# Altium schematic sheet Mainboard_Encoder_Interface.SchDoc
size 381 x 254 mm
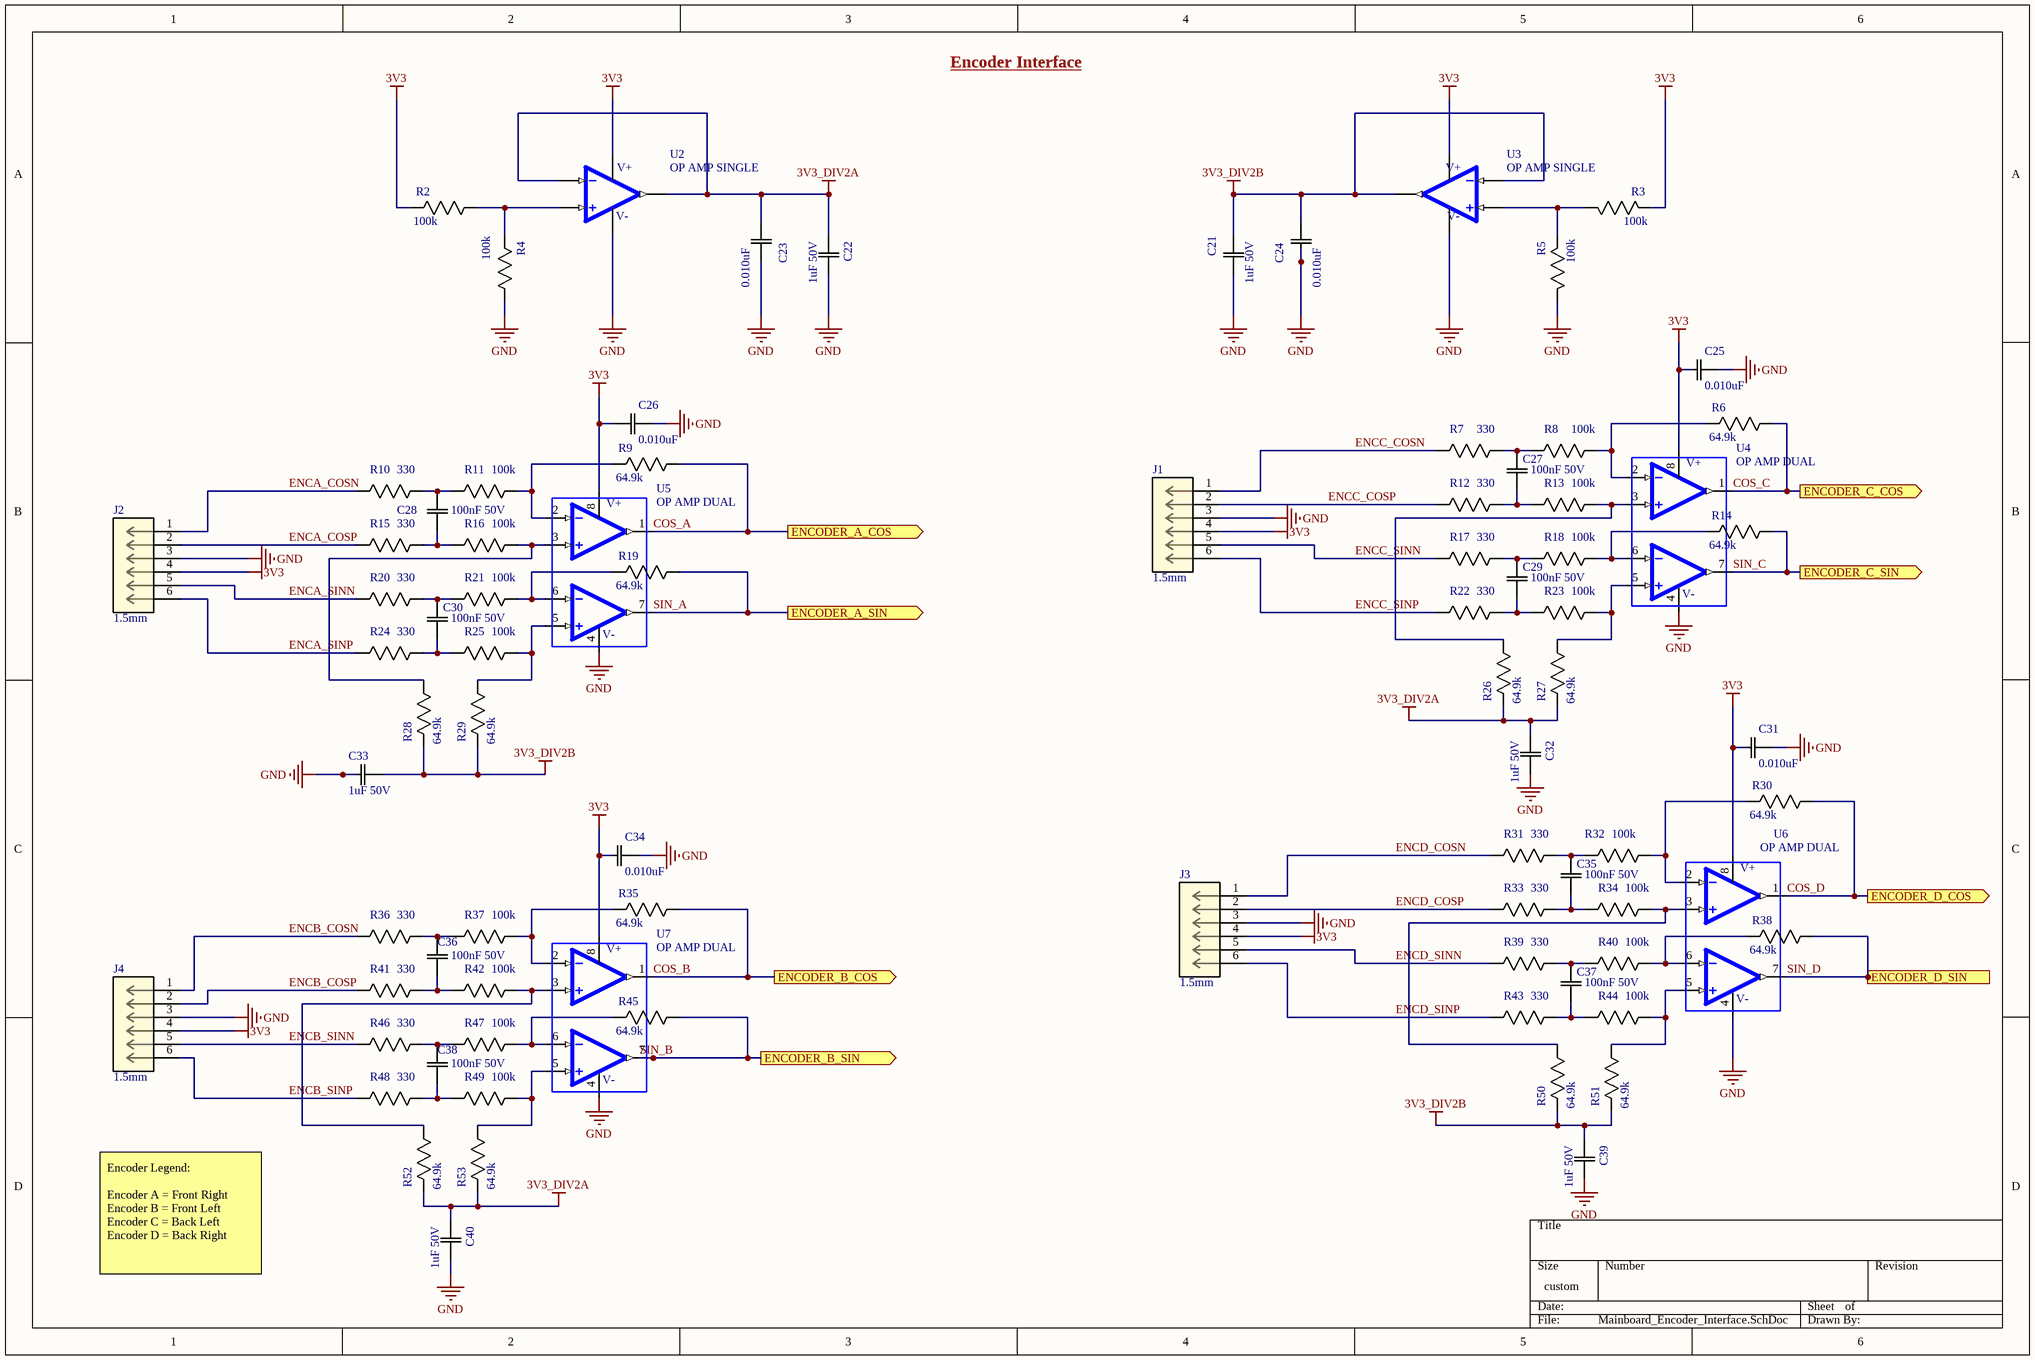
[diagram p0: Mainboard_Encoder_Interface.SchDoc]

## Parts
C21  1uF 50V  [0805]
C22  1uF 50V  [0805]
C23  0.010uF  [0805]
C24  0.010uF  [0805]
C25  0.010uF  [0805]
C26  0.010uF  [0805]
C27  100nF 50V  [0805]
C28  100nF 50V  [0805]
C29  100nF 50V  [0805]
C30  100nF 50V  [0805]
C31  0.010uF  [0805]
C32  1uF 50V  [0805]
C33  1uF 50V  [0805]
C34  0.010uF  [0805]
C35  100nF 50V  [0805]
C36  100nF 50V  [0805]
C37  100nF 50V  [0805]
C38  100nF 50V  [0805]
C39  1uF 50V  [0805]
C40  1uF 50V  [0805]
J1  1.5mm  [6POS JST]
J2  1.5mm  [6POS JST]
J3  1.5mm  [6POS JST]
J4  1.5mm  [6POS JST]
R2  100k  [0805]
R3  100k  [0805]
R4  100k  [0805]
R5  100k  [0805]
R6  64.9k  [0805]
R7  330  [0805]
R8  100k  [0805]
R9  64.9k  [0805]
R10  330  [0805]
R11  100k  [0805]
R12  330  [0805]
R13  100k  [0805]
R14  64.9k  [0805]
R15  330  [0805]
R16  100k  [0805]
R17  330  [0805]
R18  100k  [0805]
R19  64.9k  [0805]
R20  330  [0805]
R21  100k  [0805]
R22  330  [0805]
R23  100k  [0805]
R24  330  [0805]
R25  100k  [0805]
R26  64.9k  [0805]
R27  64.9k  [0805]
R28  64.9k  [0805]
R29  64.9k  [0805]
R30  64.9k  [0805]
R31  330  [0805]
R32  100k  [0805]
R33  330  [0805]
R34  100k  [0805]
R35  64.9k  [0805]
R36  330  [0805]
R37  100k  [0805]
R38  64.9k  [0805]
R39  330  [0805]
R40  100k  [0805]
R41  330  [0805]
R42  100k  [0805]
R43  330  [0805]
R44  100k  [0805]
R45  64.9k  [0805]
R46  330  [0805]
R47  100k  [0805]
R48  330  [0805]
R49  100k  [0805]
R50  64.9k  [0805]
R51  64.9k  [0805]
R52  64.9k  [0805]
R53  64.9k  [0805]
U2  OP AMP SINGLE  [SOT95P280X145-5N]
U3  OP AMP SINGLE  [SOT95P280X145-5N]
U4  OP AMP DUAL  [8-MSOP]
U5  OP AMP DUAL  [8-MSOP]
U6  OP AMP DUAL  [8-MSOP]
U7  OP AMP DUAL  [8-MSOP]

## Ports
ENCODER_A_COS (out), ENCODER_A_SIN (out), ENCODER_B_COS (out), ENCODER_B_SIN (out), ENCODER_C_COS (out), ENCODER_C_SIN (out), ENCODER_D_COS (out), ENCODER_D_SIN (out)

## Nets
3V3: C25.1(C1) C26.1(C1) C31.1(C1) C34.1(C1) J1.4 J2.4 J3.4 J4.4 R2.2(R2) R3.2(R2) U2.5(V+) U3.5(V+) U4.8(V+) U5.8(V+) U6.8(V+) U7.8(V+)
3V3_DIV2A: C22.1(C1) C23.1(C1) C32.1(C1) C40.1(C1) R26.2(R2) R27.2(R2) R52.2(R2) R53.2(R2) U2.1(OUT) U2.4(IN-)
3V3_DIV2B: C21.1(C1) C24.1(C1) C33.2(C2) C39.1(C1) R28.2(R2) R29.2(R2) R50.2(R2) R51.2(R2) U3.1(OUT) U3.4(IN-)
GND: C21.2(C2) C22.2(C2) C23.2(C2) C24.2(C2) C25.2(C2) C26.2(C2) C31.2(C2) C32.2(C2) C33.1(C1) C34.2(C2) C39.2(C2) C40.2(C2) J1.3 J2.3 J3.3 J4.3 R4.1(R1) R5.1(R1) U2.2(V-) U3.2(V-) U4.4(V-) U5.4(V-) U6.4(V-) U7.4(V-)
COS_A: R9.1(R1) U5.1(OUTA) ; port ENCODER_A_COS
COS_B: R35.1(R1) U7.1(OUTA) ; port ENCODER_B_COS
COS_C: R6.1(R1) U4.1(OUTA) ; port ENCODER_C_COS
COS_D: R30.1(R1) U6.1(OUTA) ; port ENCODER_D_COS
ENCA_COSN: J2.1 R10.2(R2)
ENCA_COSP: J2.2 R15.2(R2)
ENCA_SINN: J2.5 R20.2(R2)
ENCA_SINP: J2.6 R24.2(R2)
ENCB_COSN: J4.1 R36.2(R2)
ENCB_COSP: J4.2 R41.2(R2)
ENCB_SINN: J4.5 R46.2(R2)
ENCB_SINP: J4.6 R48.2(R2)
ENCC_COSN: J1.1 R7.2(R2)
ENCC_COSP: J1.2 R12.2(R2)
ENCC_SINN: J1.5 R17.2(R2)
ENCC_SINP: J1.6 R22.2(R2)
ENCD_COSN: J3.1 R31.2(R2)
ENCD_COSP: J3.2 R33.2(R2)
ENCD_SINN: J3.5 R39.2(R2)
ENCD_SINP: J3.6 R43.2(R2)
SIN_A: R19.1(R1) U5.7(OUTB) ; port ENCODER_A_SIN
SIN_B: R45.1(R1) U7.7(OUTB) ; port ENCODER_B_SIN
SIN_C: R14.1(R1) U4.7(OUTB) ; port ENCODER_C_SIN
SIN_D: R38.1(R1) U6.7(OUTB) ; port ENCODER_D_SIN
NetC27_1: C27.1(C1) R7.1(R1) R8.2(R2)
NetC27_2: C27.2(C2) R12.1(R1) R13.2(R2)
NetC28_1: C28.1(C1) R10.1(R1) R11.2(R2)
NetC28_2: C28.2(C2) R15.1(R1) R16.2(R2)
NetC29_1: C29.1(C1) R17.1(R1) R18.2(R2)
NetC29_2: C29.2(C2) R22.1(R1) R23.2(R2)
NetC30_1: C30.1(C1) R20.1(R1) R21.2(R2)
NetC30_2: C30.2(C2) R24.1(R1) R25.2(R2)
NetC35_1: C35.1(C1) R31.1(R1) R32.2(R2)
NetC35_2: C35.2(C2) R33.1(R1) R34.2(R2)
NetC36_1: C36.1(C1) R36.1(R1) R37.2(R2)
NetC36_2: C36.2(C2) R41.1(R1) R42.2(R2)
NetC37_1: C37.1(C1) R39.1(R1) R40.2(R2)
NetC37_2: C37.2(C2) R43.1(R1) R44.2(R2)
NetC38_1: C38.1(C1) R46.1(R1) R47.2(R2)
NetC38_2: C38.2(C2) R48.1(R1) R49.2(R2)
NetR2_1: R2.1(R1) R4.2(R2) U2.3(IN+)
NetR3_1: R3.1(R1) R5.2(R2) U3.3(IN+)
NetR6_2: R6.2(R2) R8.1(R1) U4.2(INA-)
NetR9_2: R9.2(R2) R11.1(R1) U5.2(INA-)
NetR13_1: R13.1(R1) R26.1(R1) U4.3(INA+)
NetR14_2: R14.2(R2) R18.1(R1) U4.6(INB-)
NetR16_1: R16.1(R1) R28.1(R1) U5.3(INA+)
NetR19_2: R19.2(R2) R21.1(R1) U5.6(INB-)
NetR23_1: R23.1(R1) R27.1(R1) U4.5(INB+)
NetR25_1: R25.1(R1) R29.1(R1) U5.5(INB+)
NetR30_2: R30.2(R2) R32.1(R1) U6.2(INA-)
NetR34_1: R34.1(R1) R50.1(R1) U6.3(INA+)
NetR35_2: R35.2(R2) R37.1(R1) U7.2(INA-)
NetR38_2: R38.2(R2) R40.1(R1) U6.6(INB-)
NetR42_1: R42.1(R1) R52.1(R1) U7.3(INA+)
NetR44_1: R44.1(R1) R51.1(R1) U6.5(INB+)
NetR45_2: R45.2(R2) R47.1(R1) U7.6(INB-)
NetR49_1: R49.1(R1) R53.1(R1) U7.5(INB+)

## Notes on the sheet
- Encoder Interface
- Encoder Legend:
  Encoder A = Front Right
  Encoder B = Front Left
  Encoder C = Back Left
  Encoder D = Back Right

## Library data of the parts
C21 C22 C32 C33 C39 C40 = CAP 1uF 50V: CAP CER 1UF 50V X7R 0805; Tolerance: 10%; Package: 0805; Value: 1uF; Rating: 50V; Temperature Coefficient: X7R; Operating Temperature: -55°C ~ 125°C
C23-C26 C31 C34 = CAP 0.010uF 50V: CAP CER 0.010UF 50V X7R 0603/0805; Tolerance: 10%; Package: 0603/0805; Value: 0.010uF; Rating: 50V; Temperature Coefficient: X7R; Operating Temperature: -55°C ~ 125°C
C27-C30 C35-C38 = CAP 100nF 50V: CAP CER 0.1UF 50V X7R 0805; Tolerance: 10%; Package: 0805; Value: 100nF; Rating: 50V
J1-J4 = CN 6POS JST RA: Conn Shrouded Header HDR 6 POS 1.5mm Solder RA Thru-Hole Box; Manufacturer: JST; Manufacturer Part Number: S6B-ZR(LF)(SN); Body Plating: Tin; Number of Positions: 6; Current Rating: 1A; Connector Type: Header,Male Pin; Contact Resistance: 30mR; Voltage Rating: 50V; Gender: Male; Insulation Resistance: 500MR; Panel Thickness: 3.5mm; Supplier 1: Digi-Key; RoHS: Yes; Category: Headers and Wire Housings; Stock 1: 14808; Mount: Through Hole; Number of Pins: 6; Color: White; Contact Plating: Tin,Copper; Contact Material: Brass,Tin,Copper; Housing Color: Beige; Housing Material: Polyamide; Material: Nylon; Contact Shape: Circular; Insulation Material: Nylon; Insulation Color: Natural; Min Operating Temperature: -25°C; Max Operating Temperature: 85°C; Number of Rows: 1; Packaging: Bulk; Termination: Solder; Fastening Type: Detent; Number of Contacts: 6; Max Voltage Rating (AC): 50V; Max Current Rating: 1A; Orientation: Right Angle; Voltage Rating (AC): 50V; Voltage Rating (DC): 50V; Length: 10.5mm; Width: 3.5mm; Height: 7.2mm; Pitch: 1.5mm; Depth: 6mm; Lead Pitch: 1.5mm; Contact Mating Length: 0.094inch; Lead Free: Lead Free; Flammability Rating: UL94 V-0; REACH SVHC: No SVHC; ComponentLink1URL: https://datasheet.ciiva.com/8052/80556-8052225.pdf?src-supplier=Element14; ComponentLink1Description: https://datasheet.ciiva.com/8052/80556-8052225.pdf?src-supplier=Element14; ComponentLink2URL: https://datasheet.ciiva.com/25617/0900766b81147f94-25617345.pdf?src-supplier=RSComponents; ComponentLink2Description: https://datasheet.ciiva.com/25617/0900766b81147f94-25617345.pdf?src-supplier=RSComponents; ComponentLink3URL: https://datasheet.ciiva.com/11752/0900766b8082f593-11752194.pdf?src-supplier=RSComponents; ComponentLink3Description: https://datasheet.ciiva.com/11752/0900766b8082f593-11752194.pdf?src-supplier=RSComponents; ComponentLink4URL: https://datasheet.ciiva.com/26894/getdatasheetpartid-642095-26894637.pdf?src-supplier=Verical; ComponentLink4Description: https://datasheet.ciiva.com/26894/getdatasheetpartid-642095-26894637.pdf?src-supplier=Verical; ComponentLink5URL: https://datasheet.ciiva.com/712/ezh-712560.pdf?src-supplier=Digi-Key; ComponentLink5Description: https://datasheet.ciiva.com/712/ezh-712560.pdf?src-supplier=Digi-Key; ComponentLink6URL: https://datasheet.ciiva.com/16484/s6b-zrlfsn-16484554.pdf?src-supplier=Future+Electronics; ComponentLink6Description: https://datasheet.ciiva.com/16484/s6b-zrlfsn-16484554.pdf?src-supplier=Future+Electronics; Supplier Part Number 1: 455-1673-ND
R2-R5 R8 R11 R13 R16 R18 R21 R23 R25 R32 R34 R37 R40 R42 R44 R47 R49 = RES 100k 1/8W - 1%: RES SMD 100K OHM 1% 1/8W 0805; Power (Watts): 0.125W; Package: 0805; Value: 100k; Tolerance: 1%
R6 R9 R14 R19 R26-R30 R35 R38 R45 R50-R53 = RES 64.9k 1/8W: RES SMD 64.9K OHM 1% 1/8W 0805; Power (Watts): 0.125W; Package: 0805; Value: 64.9k; Tolerance: 1%; ComponentLink1Description: digikey; ComponentLink1URL: https://www.digikey.ca/en/products/detail/yageo/RC0805FR-0764K9L/728090
R7 R10 R12 R15 R17 R20 R22 R24 R31 R33 R36 R39 R41 R43 R46 R48 = RES 330.0 1/8W - 1%: RES SMD 330 OHM 1% 1/8W 0805; Rating: 0.125W; Package: 0805; Value: 330; Tolerance: 1%
U2 U3 = OP AMP SINGLE: ANALOG DEVICES - ADA4505-1ARJZ-R7 - IC, AMPLIF. OPER., R-R, CMOS, SOT23-5; Min Supply Voltage: 1.8V; Max Supply Voltage: 5V; Min Dual Supply Voltage: 900mV; Max Dual Supply Voltage: 2.5V; Voltage Gain: 120dB; Common Mode Rejection Ratio: 105dB; Gain Bandwidth Product: 50kHz; Slew Rate: 0.006V/µs; Operating Supply Voltage: 3V; Number of Circuits: 1; Input Bias Current: 500nA; Input Offset Voltage (Vos): 3mV; Operating Supply Current: 9uA; Output Current per Channel: 40mA; Power Supply Rejection Ratio (PSRR): 110dB; Input Capacitance: 4.7pF; Supplier 1: Digi-Key; Manufacturer: Analog Devices; Manufacturer Part Number: ADA4505-1ARJZ-R7; RoHS: Yes; Category: Amplifiers - Op Amps, Buffer, Instrumentation; Stock 1: 3416; Case/Package: SOT-23-5; Number of Pins: 5; Contact Plating: Tin,Matte; Min Operating Temperature: -40°C; Max Operating Temperature: 125°C; Bandwidth: 50kHz; Packaging: Tape and Reel; Package Quantity: 3000; Unity Gain Bandwidth Product: 50kHz; Number of Channels: 1; Number of Elements: 1; Number of Amplifiers: 1; Quiescent Current: 9uA; REACH SVHC: No SVHC; Lead Free: Contains Lead; ComponentLink1URL: https://datasheet.ciiva.com/22712/1610797-22712032.pdf?src-supplier=Element14; ComponentLink1Description: https://datasheet.ciiva.com/22712/1610797-22712032.pdf?src-supplier=Element14; ComponentLink2URL: https://datasheet.ciiva.com/23805/608874-23805844.pdf?src-supplier=Newark; ComponentLink2Description: https://datasheet.ciiva.com/23805/608874-23805844.pdf?src-supplier=Newark; ComponentLink3URL: https://datasheet.ciiva.com/1487/1610797-1487372.pdf?src-supplier=Element14; ComponentLink3Description: https://datasheet.ciiva.com/1487/1610797-1487372.pdf?src-supplier=Element14; Supplier Part Number 1: ADA4505-1ARJZ-R7CT-ND
U4-U7 = OP AMP DUAL: IC OPAMP VFB 50KHZ RRO 8MSOP; Manufacturer: Analog Devices; Manufacturer Part Number: ADA4505-2ARMZ; Common Mode Rejection Ratio: 105dB; Max Supply Voltage: 5V; Min Supply Voltage: 1.8V; Max Dual Supply Voltage: 2.5V; Min Dual Supply Voltage: 900mV; Voltage Gain: 120dB; Operating Supply Voltage: 3V; Slew Rate: 0.006V/µs; Input Offset Voltage (Vos): 3mV; Input Bias Current: 0.5pA; Operating Supply Current: 14uA; Number of Channels: 2; Power Supply Rejection Ratio (PSRR): 110dB; Output Current per Channel: 40mA; Quiescent Current: 7uA; Input Capacitance: 4.7pF; Supply Type: Single,Dual; Supplier 1: Digi-Key; RoHS: Yes; Category: Amplifiers - Op Amps, Buffer, Instrumentation; Stock 1: 767; Case/Package: MSOP; Number of Pins: 8; Contact Plating: Tin,Matte; Min Operating Temperature: -40°C; Max Operating Temperature: 125°C; Gain Bandwidth Product: 50kHz; Packaging: Rail/Tube; Package Quantity: 50; Unity Gain Bandwidth Product: 50kHz; Number of Circuits: 2; Number of Elements: 2; Number of Amplifiers: 2; Max Input Voltage: 5V; Nominal Supply Current: 7uA; Bandwidth: 50kHz; Length: 3.2mm; Width: 3.2mm; Height: 0.95mm; Lead Free: Contains Lead; REACH SVHC: No SVHC; ComponentLink1URL: https://datasheet.ciiva.com/24017/ada4505-1-4505-2-4505-4-249280-24017665.pdf?src-supplier=Mouser; ComponentLink1Description: https://datasheet.ciiva.com/24017/ada4505-1-4505-2-4505-4-249280-24017665.pdf?src-supplier=Mouser; ComponentLink2URL: https://datasheet.ciiva.com/2974/ada4505-1-4505-2-4505-4-2974772.pdf?src-supplier=Avnet; ComponentLink2Description: https://datasheet.ciiva.com/2974/ada4505-1-4505-2-4505-4-2974772.pdf?src-supplier=Avnet; ComponentLink3URL: https://datasheet.ciiva.com/17569/ada4505-1-4505-2-4505-4-17569270.pdf?src-supplier=Avnet+Europe; ComponentLink3Description: https://datasheet.ciiva.com/17569/ada4505-1-4505-2-4505-4-17569270.pdf?src-supplier=Avnet+Europe; ComponentLink4URL: https://datasheet.ciiva.com/1805/ada4505-1-4505-2-4505-4-1805784.pdf?src-supplier=Digi-Key; ComponentLink4Description: https://datasheet.ciiva.com/1805/ada4505-1-4505-2-4505-4-1805784.pdf?src-supplier=Digi-Key; Supplier Part Number 1: ADA4505-2ARMZ-ND